# EAGLE schematic vrs6907 (EAGLE 6.6.0)
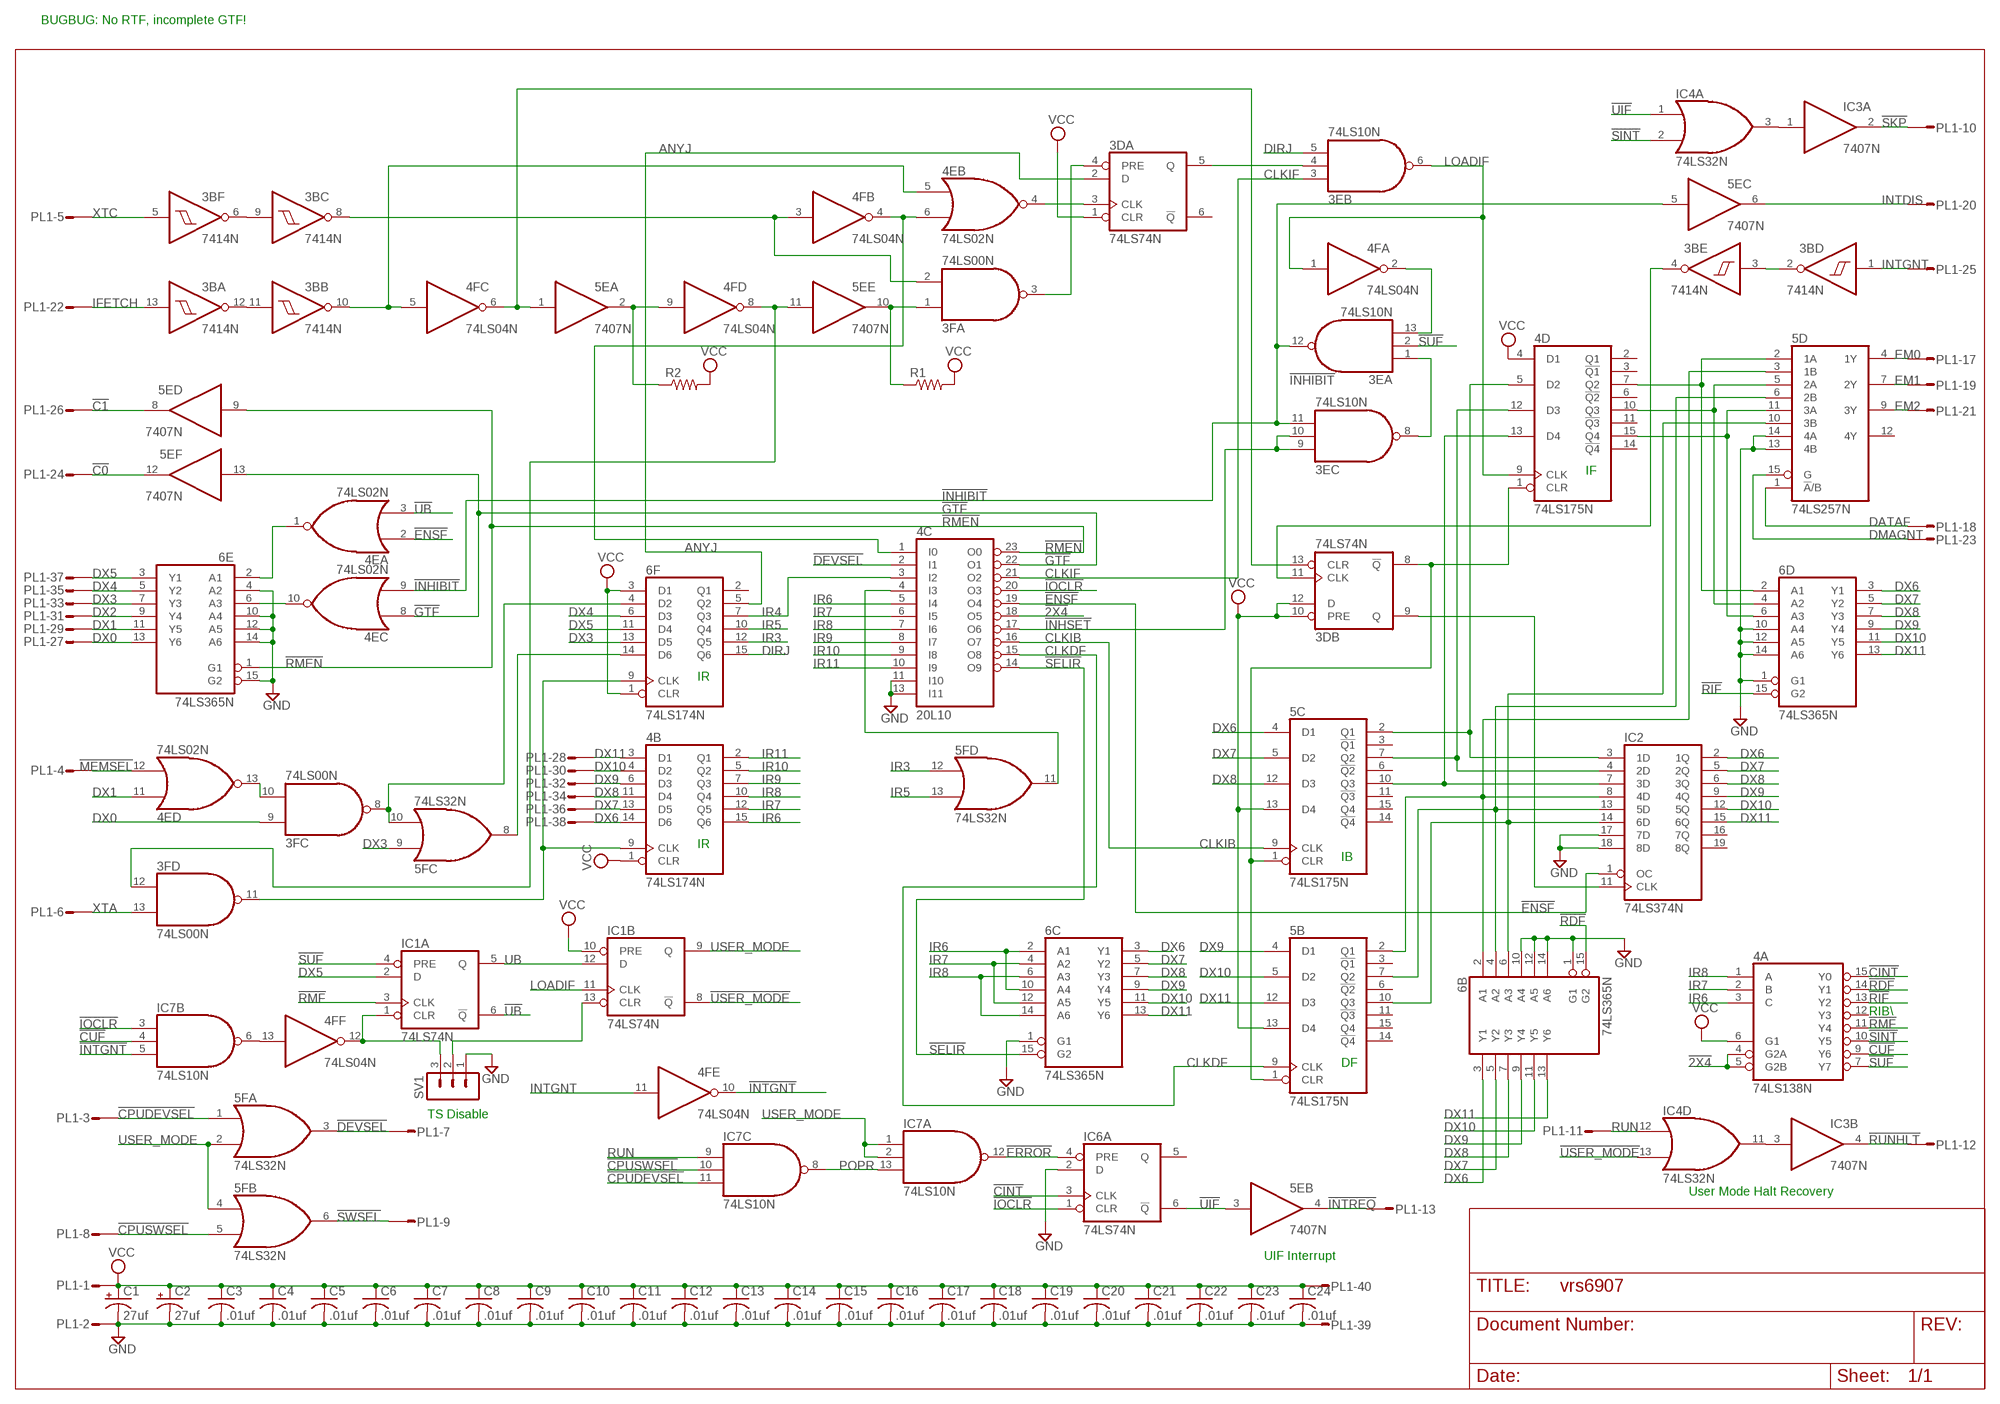
[diagram p0: schematic, sheet 1]

## Parts
3B  7414N  [DIL14]
3D  74LS74N  [DIL14]
3E  74LS10N  [DIL14]
3F  74LS00N  [DIL14]
4A  74LS138N  [DIL16]
4B  74LS174N  [DIL16]
4C  20L10  [DIL24-3]
4D  74LS175N  [DIL16]
4E  74LS02N  [DIL14]
4F  74LS04N  [DIL14]
5B  74LS175N  [DIL16]
5C  74LS175N  [DIL16]
5D  74LS257N  [DIL16]
5E  7407N  [DIL14]
5F  74LS32N  [DIL14]
6B  74LS365N  [DIL16]
6C  74LS365N  [DIL16]
6D  74LS365N  [DIL16]
6E  74LS365N  [DIL16]
6F  74LS174N  [DIL16]
C1  27uf  CPOL-USE22-6AXIAL  [E22-6]
C2  27uf  CPOL-USE22-6AXIAL  [E22-6]
C3  .01uf  C-US050-025X075  [C050-025X075]
C4  .01uf  C-US050-025X075  [C050-025X075]
C5  .01uf  C-US050-025X075  [C050-025X075]
C6  .01uf  C-US050-025X075  [C050-025X075]
C7  .01uf  C-US050-025X075  [C050-025X075]
C8  .01uf  C-US050-025X075  [C050-025X075]
C9  .01uf  C-US050-025X075  [C050-025X075]
C10  .01uf  C-US050-025X075  [C050-025X075]
C11  .01uf  C-US050-025X075  [C050-025X075]
C12  .01uf  C-US050-025X075  [C050-025X075]
C13  .01uf  C-US050-025X075  [C050-025X075]
C14  .01uf  C-US050-025X075  [C050-025X075]
C15  .01uf  C-US050-025X075  [C050-025X075]
C16  .01uf  C-US050-025X075  [C050-025X075]
C17  .01uf  C-US050-025X075  [C050-025X075]
C18  .01uf  C-US050-025X075  [C050-025X075]
C19  .01uf  C-US050-025X075  [C050-025X075]
C20  .01uf  C-US050-025X075  [C050-025X075]
C21  .01uf  C-US050-025X075  [C050-025X075]
C22  .01uf  C-US050-025X075  [C050-025X075]
C23  .01uf  C-US050-025X075  [C050-025X075]
C24  .01uf  C-US050-025X075  [C050-025X075]
IC1  74LS74N  [DIL14]
IC2  74LS374N  [DIL20]
IC3  7407N  [DIL14]
IC4  74LS32N  [DIL14]
IC6  74LS74N  [DIL14]
IC7  74LS10N  [DIL14]
PL1  40VS  [40V]
R1  R-US_0207/10  [0207/10]
R2  R-US_0207/10  [0207/10]
SV1  MA03-1  [MA03-1]

## Nets
!2X4: 4A.4(G2A) 4A.5(G2B) 4C.18(O5)
!C0: 5E.12(F:O) PL1.24
!C1: 5E.8(D:O) PL1.26
!CINT: 4A.15(Y0) IC6.3(A:CLK)
!CPUDEVSEL: 5F.1(A:I0) IC7.11(C:I2) PL1.3
!CPUSWSEL: 5F.5(B:I1) IC7.10(C:I1) PL1.8
!CUF: 4A.9(Y6) IC7.4(B:I1)
!DEVSEL: 4C.2(I1) 5F.3(A:O) PL1.7
!ENSF: 4C.19(O4) 4E.2(A:I0) IC2.1(OC)
!ERROR: IC6.4(A:PRE) IC7.12(A:O)
!GTF: 4C.22(O1) 4E.8(C:I0) 5E.13(F:I)
!INHIBIT: 3E.11(C:I2) 3E.12(A:O) 4E.9(C:I1) 5E.5(C:I)
!INHSET: 3E.9(C:I0) 3E.10(C:I1) 4C.17(O6)
!INTGNT: 4F.10(E:O) IC7.5(B:I2)
!INTREQ: 5E.4(B:O) PL1.13
!IOCLR: 4C.20(O3) IC6.1(A:CLR) IC7.3(B:I0)
!MEMSEL: 4E.12(D:I1) PL1.4
!RDF: 4A.14(Y1) 6B.15(G2)
!RIF: 4A.13(Y2) 6D.15(G2)
!RMEN: 4C.23(O0) 5E.9(D:I) 6E.1(G1)
!RMF: 4A.11(Y4) IC1.3(A:CLK)
!RUNHLT: IC3.4(B:O) PL1.12
!SELIR: 4C.14(O9) 6C.15(G2)
!SINT: 4A.10(Y5) IC4.2(A:I1)
!SKP: IC3.2(A:O) PL1.10
!SUF: 3E.2(A:I1) 4A.7(Y7) IC1.4(A:PRE)
!SWSEL: 5F.6(B:O) PL1.9
!UB: 4E.3(A:I1) IC1.6(A:!Q)
!UIF: 5E.3(B:I) IC4.1(A:I0) IC6.6(A:!Q)
!USER_MODE: IC1.8(B:!Q) IC4.13(D:I1)
ANYJ: 3D.2(A:D) 6F.5(Q2)
CLKDF: 4C.15(O8) 5B.9(CLK)
CLKIB: 4C.16(O7) 5C.9(CLK)
CLKIF: 3E.3(B:I0) 4C.21(O2)
DATAF: 5D.1(!A!/B) PL1.18
DIRJ: 3E.5(B:I2) 6F.15(Q6)
DMAGNT: 5D.15(G) PL1.23
DX0: 3F.9(C:I0) 6E.13(Y6) PL1.27
DX1: 4E.11(D:I0) 6E.11(Y5) PL1.29
DX2: 6E.9(Y4) PL1.31
DX3: 5F.9(C:I0) 6E.7(Y3) 6F.13(D5) PL1.33
DX4: 6E.5(Y2) 6F.6(D3) PL1.35
DX5: 6E.3(Y1) 6F.11(D4) IC1.2(A:D) PL1.37
DX6: 4B.14(D6) 5C.4(D1) 6B.3(Y1) 6C.3(Y1) 6D.3(Y1) IC2.2(1Q) PL1.38
DX7: 4B.13(D5) 5C.5(D2) 6B.5(Y2) 6C.5(Y2) 6D.5(Y2) IC2.5(2Q) PL1.36
DX8: 4B.11(D4) 5C.12(D3) 6B.7(Y3) 6C.7(Y3) 6D.7(Y3) IC2.6(3Q) PL1.34
DX9: 4B.6(D3) 5B.4(D1) 6B.9(Y4) 6C.9(Y4) 6D.9(Y4) IC2.9(4Q) PL1.32
DX10: 4B.4(D2) 5B.5(D2) 6B.11(Y5) 6C.11(Y5) 6D.11(Y5) IC2.12(5Q) PL1.30
DX11: 4B.3(D1) 5B.12(D3) 6B.13(Y6) 6C.13(Y6) 6D.13(Y6) IC2.15(6Q) PL1.28
EM0: 5D.4(1Y) PL1.17
EM1: 5D.7(2Y) PL1.19
EM2: 5D.9(3Y) PL1.21
GND: 4C.11(I10) 4C.13(I11) 5D.13(4B) 5D.14(4A) 6B.1(G1) 6B.10(A4) 6B.12(A5) 6B.14(A6) 6C.1(G1) 6D.1(G1) 6D.10(A4) 6D.12(A5) 6D.14(A6) 6E.4(A2) 6E.10(A4) 6E.12(A5) 6E.14(A6) 6E.15(G2) C1.- C2.- C3.2 C4.2 C5.2 C6.2 C7.2 C8.2 C9.2 C10.2 C11.2 C12.2 C13.2 C14.2 C15.2 C16.2 C17.2 C18.2 C19.2 C20.2 C21.2 C22.2 C23.2 C24.2 IC2.17(7D) IC2.18(8D) IC6.2(A:D) PL1.2 PL1.39 SV1.1
IFETCH: 3B.13(A:I) PL1.22
INTDIS: 5E.6(C:O) PL1.20
INTGNT: 3B.1(D:I) 4F.11(E:I) PL1.25
IR3: 5F.12(D:I0) 6F.12(Q5)
IR4: 4C.3(I2) 6F.7(Q3)
IR5: 5F.13(D:I1) 6F.10(Q4)
IR6: 4A.3(C) 4B.15(Q6) 4C.5(I4) 6C.2(A1) 6C.10(A4)
IR7: 4A.2(B) 4B.12(Q5) 4C.6(I5) 6C.4(A2) 6C.12(A5)
IR8: 4A.1(A) 4B.10(Q4) 4C.7(I6) 6C.6(A3) 6C.14(A6)
IR9: 4B.7(Q3) 4C.8(I7)
IR10: 4B.5(Q2) 4C.9(I8)
IR11: 4B.2(Q1) 4C.10(I9)
LOADIF: 3E.6(B:O) 4D.9(CLK) 4F.1(A:I) IC1.11(B:CLK)
LOADIR: 3F.11(D:O) 4B.9(CLK) 6F.9(CLK)
N$1: 3B.11(B:I) 3B.12(A:O)
N$2: 3B.6(F:O) 3B.9(C:I)
N$3: 3B.8(C:O) 3F.2(A:I1) 4F.3(B:I)
N$4: 3B.10(B:O) 4E.5(B:I0) 4F.5(C:I)
N$5: 3D.13(B:CLR) 4F.6(C:O) 5E.1(A:I)
N$6: 3D.5(A:Q) 3E.4(B:I1)
N$7: 3F.1(A:I0) 5E.10(E:O) R1.1
N$8: 3F.12(D:I0) 4F.8(D:O) 5E.11(E:I)
N$9: 4F.9(D:I) 5E.2(A:O) R2.1
N$10: 4C.1(I0) 4E.6(B:I1) 4F.4(B:O)
N$11: 3D.3(A:CLK) 4E.4(B:O)
N$12: 3D.4(A:PRE) 3F.3(A:O)
N$13: IC3.3(B:I) IC4.11(D:O)
N$14: 3F.10(C:I1) 4E.13(D:O)
N$15: 4E.10(C:O) 6E.6(A3)
N$16: 4F.12(F:O) IC1.1(A:CLR) SV1.3
N$17: 4E.1(A:O) 6E.2(A1)
N$18: 3F.8(C:O) 5F.10(C:I1) 6F.4(D2)
N$19: 5F.8(C:O) 6F.14(D6)
N$20: 4C.4(I3) 5F.11(D:O)
N$24: IC1.13(B:CLR) SV1.2
N$25: IC3.1(A:I) IC4.3(A:O)
N$26: 4F.13(F:I) IC7.6(B:O)
N$45: 4D.7(Q2) 5D.2(1A) 6D.2(A1)
N$46: 4D.15(Q4) 5D.11(3A) 6D.6(A3)
N$47: 4D.10(Q3) 5D.5(2A) 6D.4(A2)
N$48: 3D.8(B:!Q) 4D.1(CLR) 5B.1(CLR) 5C.1(CLR)
N$50: 4D.5(D2) 5C.2(Q1) IC2.3(1D)
N$51: 4D.12(D3) 5C.7(Q2) IC2.4(2D)
N$52: 4D.13(D4) 5C.10(Q3) IC2.7(3D)
N$53: 5B.2(Q1) 5D.3(1B) 6B.2(A1) IC2.8(4D)
N$54: 5B.7(Q2) 5D.6(2B) 6B.4(A2) IC2.13(5D)
N$55: 5B.10(Q3) 5D.10(3B) 6B.6(A3) IC2.14(6D)
N$59: 3D.9(B:Q) IC2.11(CLK)
N$70: 3E.1(A:I0) 3E.8(C:O)
N$71: 3E.13(A:I2) 4F.2(A:O)
N$72: 3B.2(D:O) 3B.3(E:I)
N$74: 3B.4(E:O) 3D.11(B:CLK)
POPR: IC7.8(C:O) IC7.13(A:I2)
RUN: IC4.12(D:I0) IC7.9(C:I0) PL1.11
UB: IC1.5(A:Q) IC1.12(B:D)
USER_MODE: 5F.2(A:I1) 5F.4(B:I0) IC1.9(B:Q) IC7.1(A:I0) IC7.2(A:I1)
VCC: 3D.1(A:CLR) 3D.10(B:PRE) 3D.12(B:D) 4A.6(G1) 4B.1(CLR) 4D.4(D1) 5B.13(D4) 5C.13(D4) 6F.1(CLR) 6F.3(D1) C1.+ C2.+ C3.1 C4.1 C5.1 C6.1 C7.1 C8.1 C9.1 C10.1 C11.1 C12.1 C13.1 C14.1 C15.1 C16.1 C17.1 C18.1 C19.1 C20.1 C21.1 C22.1 C23.1 C24.1 IC1.10(B:PRE) PL1.1 PL1.40 R1.2 R2.2
XTA: 3F.13(D:I1) PL1.6
XTC: 3B.5(F:I) PL1.5
Unconnected: 3D.6(A:!Q) 3F.4(B:I0) 3F.5(B:I1) 3F.6(B:O) 4A.12(Y3) 4D.2(Q1) 4D.3(!Q1) 4D.6(!Q2) 4D.11(!Q3) 4D.14(!Q4) 5B.3(!Q1) 5B.6(!Q2) 5B.11(!Q3) 5B.14(!Q4) 5B.15(Q4) 5C.3(!Q1) 5C.6(!Q2) 5C.11(!Q3) 5C.14(!Q4) 5C.15(Q4) 5D.12(4Y) 6F.2(Q1) IC2.16(7Q) IC2.19(8Q) IC3.5(C:I) IC3.6(C:O) IC3.8(D:O) IC3.9(D:I) IC3.10(E:O) IC3.11(E:I) IC3.12(F:O) IC3.13(F:I) IC4.4(B:I0) IC4.5(B:I1) IC4.6(B:O) IC4.8(C:O) IC4.9(C:I0) IC4.10(C:I1) IC6.5(A:Q) IC6.8(B:!Q) IC6.9(B:Q) IC6.10(B:PRE) IC6.11(B:CLK) IC6.12(B:D) IC6.13(B:CLR) PL1.14 PL1.15 PL1.16

## Notes on the sheet
- BUGBUG: No RTF, incomplete GTF!
- IF
- IR
- IR
- IB
- RIB\\
- DF
- TS Disable
- User Mode Halt Recovery
- UIF Interrupt

## Power pins joined to a net without a drawn wire
GND: 3B.7(P:GND) 3D.7(P:GND) 3E.7(P:GND) 3F.7(P:GND) 4A.8(GND) 4B.8(GND) 4C.12(GND) 4D.8(GND) 4E.7(P:GND) 4F.7(P:GND) 5B.8(GND) 5C.8(GND) 5D.8(GND) 5E.7(P:GND) 5F.7(P:GND) 6B.8(GND) 6C.8(GND) 6D.8(GND) 6E.8(GND) 6F.8(GND) IC1.7(P:GND) IC2.10(GND) IC3.7(P:GND) IC4.7(P:GND) IC6.7(P:GND) IC7.7(P:GND)
VCC: 3B.14(P:VCC) 3D.14(P:VCC) 3E.14(P:VCC) 3F.14(P:VCC) 4A.16(VCC) 4B.16(VCC) 4C.24(VCC) 4D.16(VCC) 4E.14(P:VCC) 4F.14(P:VCC) 5B.16(VCC) 5C.16(VCC) 5D.16(VCC) 5E.14(P:VCC) 5F.14(P:VCC) 6B.16(VCC) 6C.16(VCC) 6D.16(VCC) 6E.16(VCC) 6F.16(VCC) IC1.14(P:VCC) IC2.20(VCC) IC3.14(P:VCC) IC4.14(P:VCC) IC6.14(P:VCC) IC7.14(P:VCC)

## Library data of the parts
3B = 74xx-us:74*14: Hex schmitt trigger INVERTER
3D IC1 IC6 = 74xx-us:74*74: Dual D type positive edge triggered FLIP FLOP, preset and clear
3E IC7 = 74xx-us:74*10: Triple 3-input NAND gate
3F = 74xx-us:74*00: Quad 2-input NAND gate
4A = 74xx-us:74*138: 3-line to 8-line DECODER/DEMULTIPLEXER
4B 6F = 74xx-us:74*174: Hex D type FLIP FLOP, clear
4C = pal:20L10: PAL; OC_FARNELL: unknown; OC_NEWARK: unknown
4D 5B 5C = 74xx-us:74*175: Qadruple D type FLIP FLOP, clear
4E = 74xx-us:74*02: Quad 2-input NOR gate
4F = 74xx-us:74*04: Hex INVERTER
5D = 74xx-us:74*257: Quadruple 2-to 1 line data SELECTOR/MULTIPLEXER
5E IC3 = 74xx-us:74*07: Hex BUFFER, open collector high-voltage output
5F IC4 = 74xx-us:74*32: Quad 2-input OR gate
6B 6C 6D 6E = 74xx-us:74*365: Hex BUS DRIVER, 3-state
C1 C2 = rcl:CPOL-US: POLARIZED CAPACITOR, American symbol
C3-C24 = rcl:C-US: CAPACITOR, American symbol
IC2 = 74xx-us:74*374: Octal D type transparent LATCH, edge triggered
PL1 = con-harting-v:40VS: CONNECTOR; OC_FARNELL: unknown; OC_NEWARK: unknown
R1 R2 = rcl:R-US_: RESISTOR, American symbol
SV1 = con-lstb:MA03-1: PIN HEADER; OC_FARNELL: unknown; OC_NEWARK: unknown